# Altium schematic sheet Sch1SingleChannels.SchDoc: Single Channel Electronics
size A4; Address1: Afshin Kashani Ilkhechi; DocumentNumber: 1; Revision: 2; SheetNumber: 1; SheetTotal: 5
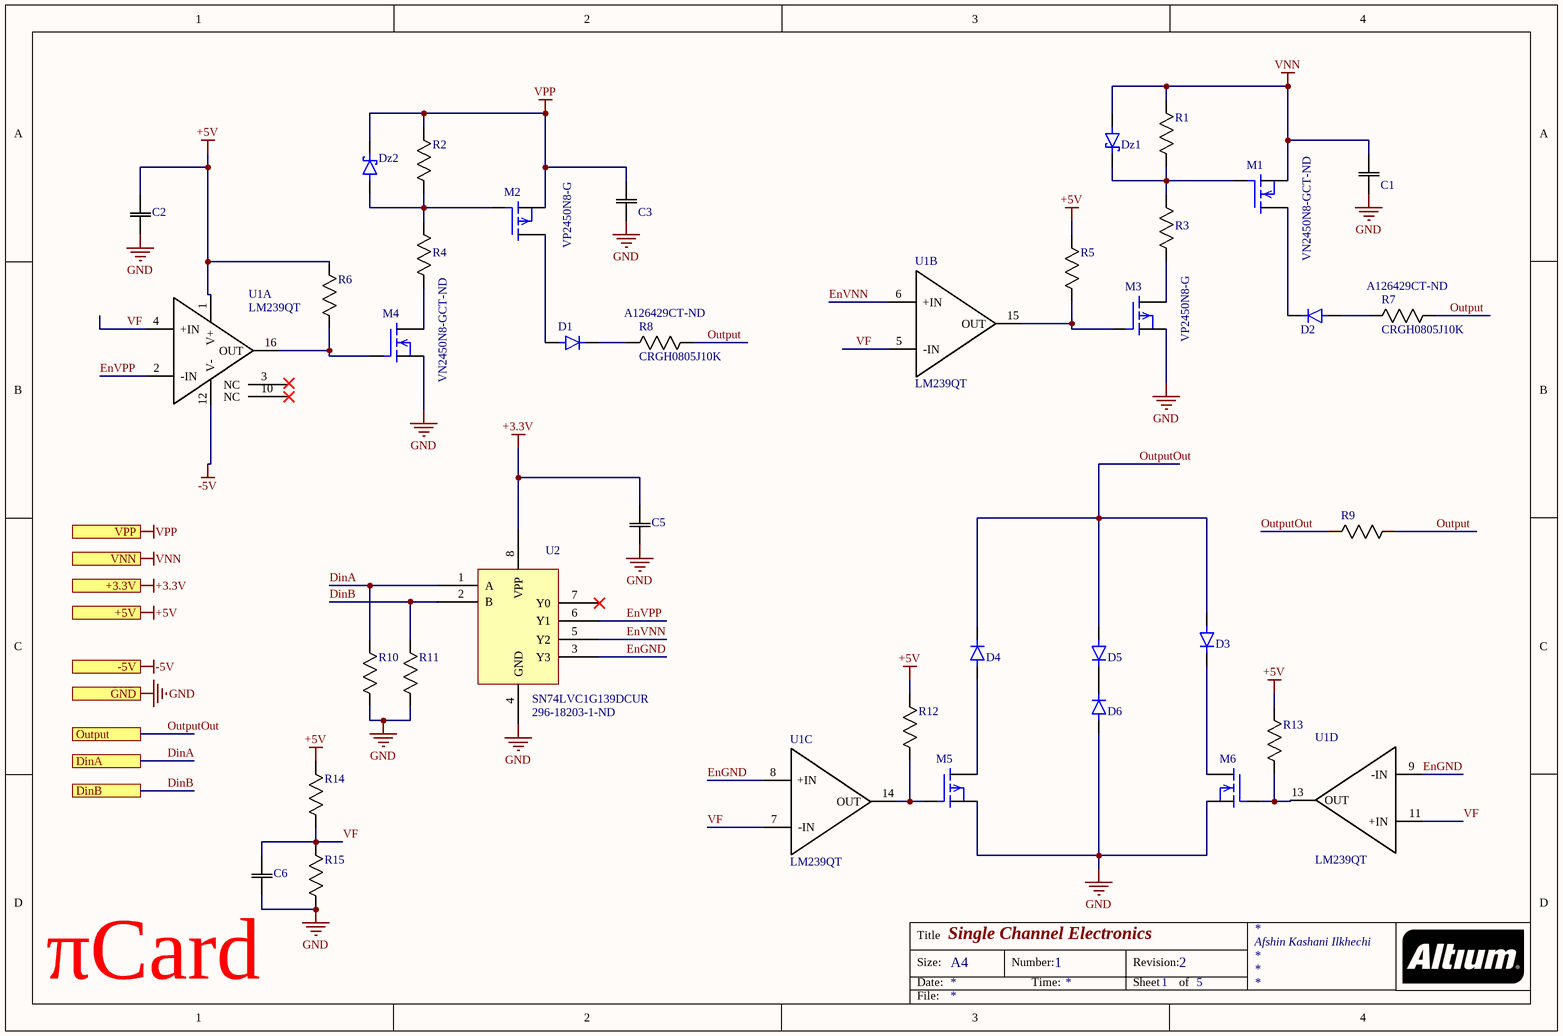
[diagram p0: Sch1SingleChannels.SchDoc]

## Parts
C1  885342207014  [C0805]  (value not drawn)
C2  C0805C104Z5VACTU  [C0805]  (value not drawn)
C3  885342207014  [C0805]  (value not drawn)
C5  C0805C104Z5VACTU  [C0805]  (value not drawn)
C6  C0805C104Z5VACTU  [C0805]  (value not drawn)
D1  CD1408-R11000  [CD1408]  (value not drawn)
D2  CD1408-R11000  [CD1408]  (value not drawn)
D3  CD1408-R11000  [CD1408]  (value not drawn)
D4  CD1408-R11000  [CD1408]  (value not drawn)
D5  CD1408-R11000  [CD1408]  (value not drawn)
D6  CD1408-R11000  [CD1408]  (value not drawn)
Dz1  BZT52C5V6STR  [SOD-323]  (value not drawn)
Dz2  BZT52C5V6STR  [SOD-323]  (value not drawn)
M1  Supplier Part Number 1: VN2450N8-GCT-ND  [SOT-89]  (hidden comment: VN2450N8-G)
M2  VP2450N8-G  [SOT-89]
M3  VP2450N8-G  [SOT-89]
M4  Supplier Part Number 1: VN2450N8-GCT-ND  [SOT-89]  (hidden comment: VN2450N8-G)
M5  VP2450N8-G  [SOT-89]  (value not drawn)
M6  VN2450N8-G  [SOT-89]  (value not drawn)
R1  RK73B1ETTP513J  [R0402]  (value not drawn)
R2  RK73B1ETTP513J  [R0402]  (value not drawn)
R3  ERJ-PA3J514V  [R0603]  (value not drawn)
R4  ERJ-PA3J514V  [R0603]  (value not drawn)
R5  RK73B1ETTP103J  [R0402]  (value not drawn)
R6  RK73B1ETTP103J  [R0402]  (value not drawn)
R7  CRGH0805J10K  Supplier Part Number 1: A126429CT-ND  [0805]
R8  CRGH0805J10K  Supplier Part Number 1: A126429CT-ND  [0805]
R9  RMCF0805ZT0R00  [0805]  (value not drawn)
R10  RK73B1ETTP103J  [R0402]  (value not drawn)
R11  RK73B1ETTP103J  [R0402]  (value not drawn)
R12  RK73B1ETTP103J  [R0402]  (value not drawn)
R13  RK73B1ETTP103J  [R0402]  (value not drawn)
R14  RK73B1ETTP103J  [R0402]  (value not drawn)
R15  RK73B1ETTP103J  [R0402]  (value not drawn)
U1  LM239QT  [16-QFN]  (parts A,B,C,D of 4)
U2  SN74LVC1G139DCUR  Supplier Part Number 1: 296-18203-1-ND  [SOP50P310X90-8N]

## Ports
+3.3V, +5V, -5V, DinA, DinB, GND, Output, VNN, VPP

## Nets
+3.3V: C5.2 U2.8(VPP) ; port +3.3V
+5V: C2.2 R5.2 R6.2 R12.2 R13.2 R14.2 U1.1(V+) ; port +5V
-5V: U1.12(V-) ; port -5V
GND: C1.1 C2.1 C3.1 C5.1 C6.1 D6.2 M3.3(S) M4.3(S) M5.3(S) M6.3(S) R10.1 R11.1 R15.1 U2.4(GND) ; port GND
VNN: C1.2 Dz1.2(A) M1.3(S) R1.2 ; port VNN
VPP: C3.2 Dz2.1(K) M2.3(S) R2.2 ; port VPP
DinA: R10.2 U2.1(A) ; port DinA
DinB: R11.2 U2.2(B) ; port DinB
EnGND: U1.8(+IN) U1.9(-IN) U2.3(Y3)
EnVNN: U1.6(+IN) U2.5(Y2)
EnVPP: U1.2(-IN) U2.6(Y1)
Output: R7.2 R8.2 R9.2
OutputOut: D3.2 D4.1 D5.2 R9.1 ; port Output
VF: C6.2 R14.1 R15.2 U1.4(+IN) U1.5(-IN) U1.7(-IN) U1.11(+IN)
NetD1_1: D1.1 R8.1
NetD1_2: D1.2 M2.2(D)
NetD2_1: D2.1 M1.2(D)
NetD2_2: D2.2 R7.1
NetD3_1: D3.1 M6.2(D)
NetD4_2: D4.2 M5.2(D)
NetD5_1: D5.1 D6.1
NetDz1_1: Dz1.1(K) M1.1(G) R1.1 R3.2
NetDz2_2: Dz2.2(A) M2.1(G) R2.1 R4.2
NetM3_1: M3.1(G) R5.1 U1.15(OUT)
NetM3_2: M3.2(D) R3.1
NetM4_1: M4.1(G) R6.1 U1.16(OUT)
NetM4_2: M4.2(D) R4.1
NetM5_1: M5.1(G) R12.1 U1.14(OUT)
NetM6_1: M6.1(G) R13.1 U1.13(OUT)

Not connected (* = marked no-connect by the designer): U1 3(NC) 10(NC)*; U2 7(Y0)*

## Notes on the sheet
- (near C6) πCard
- Title
- Size:
- Date:
- A4
- Number:
- Time:
- Revision:
- Sheet
- of
- File:

## Library data of the parts
C1 C3 = CAP805: 10 nF Cap; Supplier 1: Digi-Key; Supplier Part Number 1: 732-12169-1-ND
C2 C5 C6 = Cap_0805: Supplier 1: Digi-Key; Supplier Part Number 1: 399-1177-1-ND
D1-D6 = CD1408-R11000: Diode Standard 1000V 1A Surface Mount 1408; Supplier 1: Digi-Key; Supplier Part Number 1: CD1408-R11000CT-ND
M1 M4 M6 = VN2450N8-G: N-Channel 500V 250mA (Tj) 1.6W (Ta) Surface Mount TO-243AA (SOT-89); Supplier 1: Digi-Key
  M6: Supplier Part Number 1: VN2450N8-GCT-ND
M2 M3 = VP2450N8-G: P-Channel 500V 160mA (Tj) 1.6W (Ta) Surface Mount TO-243AA (SOT-89); Supplier 1: Digi-Key; Supplier Part Number 1: VP2450N8-GCT-ND
R1 R2 R5 R6 R10-R15 = Res_0402: Supplier 1: Digi-Key
  R1 R2: Supplier Part Number 1: 2019-RK73B1ETTP513JCT-ND
  R5 R6 R10-R15: Supplier Part Number 1: 2019-RK73B1ETTP103JCT-ND
R3 R4 = Res_0603: Supplier 1: Digi-Key; Supplier Part Number 1: P510KBZCT-ND
R7-R9 = Res_0805: Supplier 1: Digi-Key
  R9: Supplier Part Number 1: RMCF0805ZT0R00CT-ND
U1 = LM239QT: Comparator Differential CMOS, DTL, ECL, MOS, Open-Collector, TTL 16-QFN (3x3); Supplier 1: Digi-Key; Supplier Part Number 1: 497-13140-1-ND
Dz1 Dz2 = BZT52C5V6STR: Supplier 1: Digi-Key; Supplier Part Number 1: 1655-BZT52C5V6SCT-ND
M5 = VP2450N8-G: Supplier 1: Digi-Key; Supplier Part Number 1: VP2450N8-GCT-ND
U2 = SN74LVC1G139DCUR: Supplier 1: Digi-Key